# Altium schematic sheet Sheet1.SchDoc: Sheet 1
size A4; DrawnBy: Erhan YILMAZ; Engineer: Erhan YILMAZ; SheetNumber: 1; SheetTotal: 2; ProjectName: BMS
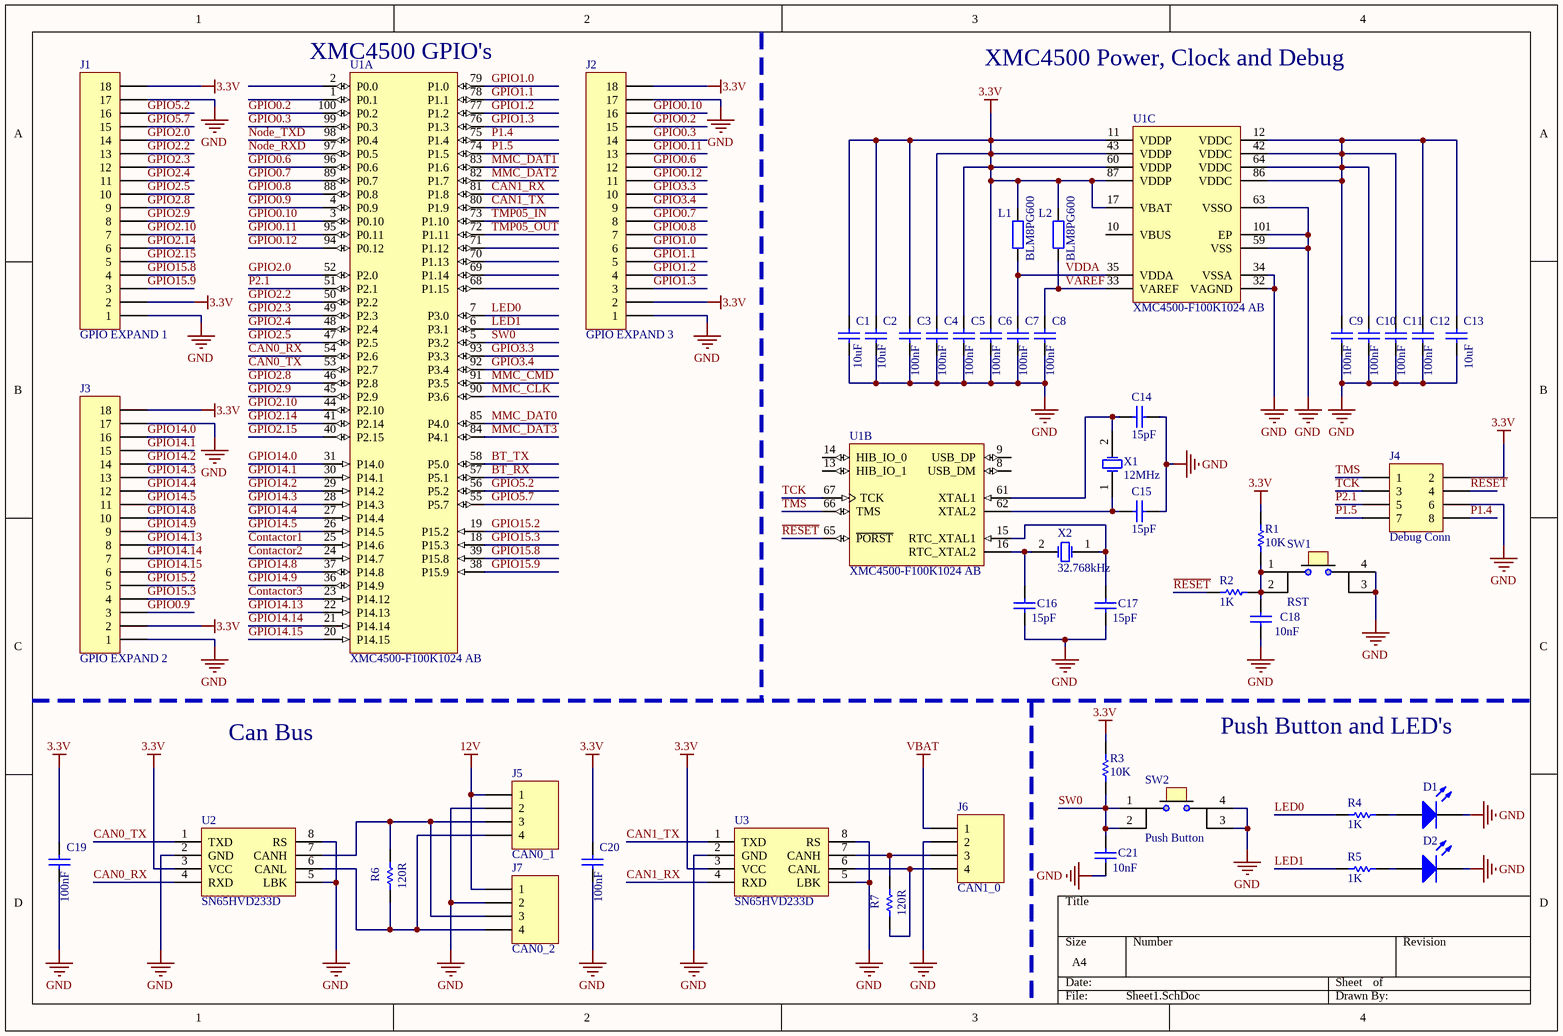
[diagram p0: Sheet1.SchDoc]

## Parts
C1  10uF  [C0805]
C2  10uF  [C0805]
C3  100nF  [1608[0603]]
C4  100nF  [1608[0603]]
C5  100nF  [1608[0603]]
C6  100nF  [1608[0603]]
C7  100nF  [1608[0603]]
C8  100nF  [1608[0603]]
C9  100nF  [1608[0603]]
C10  100nF  [1608[0603]]
C11  100nF  [1608[0603]]
C12  100nF  [1608[0603]]
C13  10uF  [C0805]
C14  15pF  [1608[0603]]
C15  15pF  [1608[0603]]
C16  15pF  [1608[0603]]
C17  15pF  [1608[0603]]
C18  10nF  [1608[0603]]
C19  100nF  [1608[0603]]
C20  100nF  [1608[0603]]
C21  10nF  [1608[0603]]
D1  SMD LED  [C0805]  (value not drawn)
D2  SMD LED  [C0805]  (value not drawn)
J1  GPIO EXPAND 1  [HDR1X18]
J2  GPIO EXPAND 3  [HDR1X18]
J3  GPIO EXPAND 2  [HDR1X18]
J4  Debug Conn  [HDR2X4]
J5  CAN0_1  [4 Pin header]
J6  CAN1_0  [4 Pin header]
J7  CAN0_2  [4 Pin header]
L1  BLM8PG600  [C0805]
L2  BLM8PG600  [C0805]
R1  10K  [1608[0603]]
R2  value 1K  [1608[0603]]  (hidden comment: 10K)
R3  10K  [1608[0603]]
R4  1K  [1608[0603]]
R5  1K  [1608[0603]]
R6  120R  [C0805]
R7  120R  [C0805]
SW1  RST  [Push Button SMD]
SW2  Push Button  [Push Button SMD]
U1  XMC4500-F100K1024 AB  [INF-PG-LQFP-100-11-7000X7000TP_N]  (parts A,B,C of 3)
U2  SN65HVD233D  [SOIC 8]
U3  SN65HVD233D  [SOIC 8]
X1  12MHz  [SMD Crystall 23.2x2.5mm]
X2  32.768kHz  [32kHz smd Crystal]

## Nets
3.3V: C1.2 C2.2 C3.2 C4.2 C5.2 C6.2 C19.2 C20.2 J1.2 J1.18 J2.2 J2.18 J3.2 J3.18 J4.2 L1.2 L2.2 R1.1 R3.1 U1.11(VDDP) U1.17(VBAT) U1.43(VDDP) U1.60(VDDP) U1.87(VDDP) U2.3(VCC) U3.3(VCC)
12V: J5.1 J7.1
GND: C1.1 C2.1 C3.1 C4.1 C5.1 C6.1 C7.1 C8.1 C9.1 C10.1 C11.1 C12.1 C13.1 C14.1 C15.1 C16.1 C17.1 C18.1 C19.1 C20.1 C21.1 D1.2(K) D2.2(K) J1.1 J1.17 J2.1 J2.17 J3.1 J3.17 J4.6 J5.2 J6.2 J7.2 SW1.3 SW1.4 SW2.3 SW2.4 U1.32(VAGND) U1.34(VSSA) U1.59(VSS) U1.63(VSSO) U1.101(EP) U2.2(GND) U2.5(LBK) U2.8(RS) U3.2(GND) U3.5(LBK) U3.8(RS)
VBAT: J6.1
BT_RX: U1.57(P5.1)
BT_TX: U1.58(P5.0)
CAN0_RX: U1.54(P2.6) U2.4(RXD)
CAN0_TX: U1.53(P2.7) U2.1(TXD)
CAN1_RX: U1.81(P1.8) U3.4(RXD)
CAN1_TX: U1.80(P1.9) U3.1(TXD)
Contactor1: U1.25(P14.6)
Contactor2: U1.24(P14.7)
Contactor3: U1.23(P14.12)
GPIO0.2: J2.15 U1.100(P0.2)
GPIO0.3: J2.14 U1.99(P0.3)
GPIO0.6: J2.12 U1.96(P0.6)
GPIO0.7: J2.8 U1.89(P0.7)
GPIO0.8: J2.7 U1.88(P0.8)
GPIO0.9: J3.3 U1.4(P0.9)
GPIO0.10: J2.16 U1.3(P0.10)
GPIO0.11: J2.13 U1.95(P0.11)
GPIO0.12: J2.11 U1.94(P0.12)
GPIO1.0: J2.6 U1.79(P1.0)
GPIO1.1: J2.5 U1.78(P1.1)
GPIO1.2: J2.4 U1.77(P1.2)
GPIO1.3: J2.3 U1.76(P1.3)
GPIO2.0: J1.14 U1.52(P2.0)
GPIO2.2: J1.13 U1.50(P2.2)
GPIO2.3: J1.12 U1.49(P2.3)
GPIO2.4: J1.11 U1.48(P2.4)
GPIO2.5: J1.10 U1.47(P2.5)
GPIO2.8: J1.9 U1.46(P2.8)
GPIO2.9: J1.8 U1.45(P2.9)
GPIO2.10: J1.7 U1.44(P2.10)
GPIO2.14: J1.6 U1.41(P2.14)
GPIO2.15: J1.5 U1.40(P2.15)
GPIO3.3: J2.10 U1.93(P3.3)
GPIO3.4: J2.9 U1.92(P3.4)
GPIO5.2: J1.16 U1.56(P5.2)
GPIO5.7: J1.15 U1.55(P5.7)
GPIO14.0: J3.16 U1.31(P14.0)
GPIO14.1: J3.15 U1.30(P14.1)
GPIO14.2: J3.14 U1.29(P14.2)
GPIO14.3: J3.13 U1.28(P14.3)
GPIO14.4: J3.12 U1.27(P14.4)
GPIO14.5: J3.11 U1.26(P14.5)
GPIO14.8: J3.10 U1.37(P14.8)
GPIO14.9: J3.9 U1.36(P14.9)
GPIO14.13: J3.8 U1.22(P14.13)
GPIO14.14: J3.7 U1.21(P14.14)
GPIO14.15: J3.6 U1.20(P14.15)
GPIO15.2: J3.5 U1.19(P15.2)
GPIO15.3: J3.4 U1.18(P15.3)
GPIO15.8: J1.4 U1.39(P15.8)
GPIO15.9: J1.3 U1.38(P15.9)
LED0: R4.2 U1.7(P3.0)
LED1: R5.2 U1.6(P3.1)
MMC_CLK: U1.90(P3.6)
MMC_CMD: U1.91(P3.5)
MMC_DAT0: U1.85(P4.0)
MMC_DAT1: U1.83(P1.6)
MMC_DAT2: U1.82(P1.7)
MMC_DAT3: U1.84(P4.1)
Node_RXD: U1.97(P0.5)
Node_TXD: U1.98(P0.4)
P1.4: J4.8 U1.75(P1.4)
P1.5: J4.7 U1.74(P1.5)
P2.1: J4.5 U1.51(P2.1)
~{RESET}: J4.4 R2.1 U1.65(~{PORST})
SW0: C21.2 R3.2 SW2.1 SW2.2 U1.5(P3.2)
TCK: J4.3 U1.67(TCK)
TMP05_IN: U1.73(P1.10)
TMP05_OUT: U1.72(P1.11)
TMS: J4.1 U1.66(TMS)
VAREF: C8.2 L2.1 U1.33(VAREF)
VDDA: C7.2 L1.1 U1.35(VDDA)
NetC9_2: C9.2 C10.2 C11.2 C12.2 C13.2 U1.12(VDDC) U1.42(VDDC) U1.64(VDDC) U1.86(VDDC)
NetC14_2: C14.2 U1.61(XTAL1) X1.2(OSC2)
NetC15_2: C15.2 U1.62(XTAL2) X1.1(OSC1)
NetC16_2: C16.2 U1.16(RTC_XTAL2) X2.2(OSC2)
NetC17_2: C17.2 U1.15(RTC_XTAL1) X2.1(OSC1)
NetC18_2: C18.2 R1.2 R2.2 SW1.1 SW1.2
NetD1_1: D1.1(A) R4.1
NetD2_1: D2.1(A) R5.1
NetJ5_3: J5.3 J7.3 R6.2 U2.7(CANH)
NetJ5_4: J5.4 J7.4 R6.1 U2.6(CANL)
NetJ6_3: J6.3 R7.2 U3.7(CANH)
NetJ6_4: J6.4 R7.1 U3.6(CANL)

Not connected (* = marked no-connect by the designer): U1 1(P0.1) 2(P0.0) 8(USB_DM) 9(USB_DP) 10(VBUS) 13(HIB_IO_1) 14(HIB_IO_0) 68(P1.15) 69(P1.14) 70(P1.13) 71(P1.12)

## Notes on the sheet
- (near U1) XMC4500 GPIO's
- XMC4500 Power, Clock and Debug
- Can Bus
- Push Button and LED's

## Library data of the parts
C1-C21 = Cap Semi: Published: 8-Jun-2000; LatestRevisionDate: 29-May-2009; LatestRevisionNote: IPC-7351 Footprint Added.; PackageReference: C1206; Publisher: Altium Limited; PackageDescription: Chip Capacitor
  C1 C2 C13: Value: 10uF
  C3-C12 C19 C20: Value: 100nF
  C14-C17: Value: 15pF
  C18 C21: Value: 10nF
D1 D2 = LED0: Published: 8-Jun-2000; LatestRevisionDate: 08-Jul-2005; LatestRevisionNote: Mech Layer 1 removed.; PackageReference: LED-0; Publisher: Altium Limited; PackageDescription: LED; 2 Leads; Value: SMD LED
J1-J3 = MHDR1X18: Header, 18-Pin; LatestRevisionDate: 17-Jul-2002; LatestRevisionNote: Re-released for DXP Platform.; Publisher: Altium Limited; Value: Header, 18-Pin
J4 = MHDR2X4: Header, 4-Pin, Dual row; LatestRevisionDate: 17-Jul-2002; LatestRevisionNote: Re-released for DXP Platform.; Publisher: Altium Limited; Value: Header, 4-Pin, Dual row
J5-J7 = 4 Pin Vertical Header: 4 pin header for CAN bus connectors
L1 L2 = Res2: Published: 8-Jun-2000; LatestRevisionDate: 17-Jul-2002; LatestRevisionNote: Re-released for DXP Platform.; PackageReference: AXIAL-0.4; Publisher: Altium Limited; PackageDescription: Axial Device, Thru-Hole; 2 Leads; 0.4 in Pin Spacing; Value: BLM8PG600
R1-R7 = Res1: Published: 8-Jun-2000; LatestRevisionDate: 17-Jul-2002; LatestRevisionNote: Re-released for DXP Platform.; PackageReference: AXIAL-0.3; Publisher: Altium Limited; PackageDescription: Axial Device, Thru-Hole; 2 Leads; 0.3 in Pin Spacing
  R1 R3: Value: 10K
  R4 R5: Value: 1K
  R6 R7: Value: 120R
SW1 SW2 = Push Button: General purposes push button; Value: Push Button
U1 = XMC4500-F100K1024 AB: 120 MHz XMC4500 MCU with 1,024 KByte Program Memory, 160 KByte SRAM, 3.3 V, -40 to 125 degC, PG-LQFP-100, Green; Manufacturer: Infineon; A / D input lines (incl. FADC): 18; Digital I/O Lines: 55; Program Memory: 1,024.0 KByte; SRAM (incl. Cache): 160.0 KByte; Type of Serial I/O Interfaces: 6xSPI, Dual SPI, Quad SPI, UART, LIN, IIC, IIS; DatasheetVersion: V1.0; PackageVersion: V11; PackageReference: PG-LQFP-100-11; PackageDescription: 100-Pin Plastic (Green) Low Profile Quad Flat Package, 14 x 14 mm Body, 0.5 mm Pitch; Halogen-free: TRUE; Mounting Technology: Surface Mount; PartNumber: XMC4500-F100K1024 AB; ComponentLink1Description: Manufacturer URL; ComponentLink1URL: http://www.infineon.com; ComponentLink2Description: Datasheet; ComponentLink2URL: http://www.infineon.com/dgdl/xmc4500_ds_v1+0_2013_01.pdf?folderId=db3a30433580b3710135a47f3eb76c98&fileId=db3a304335b504400135bdca7ed86742&location=en.Products.Microcontrollers.32-bit_Industrial_Microcontrollers_based_on_ARM__Cortex_-M.32-bit_XMC4000_Industrial_Microcontrollers_ARM__Cortex_-M4.DATASHEET.xmc4500_ds_v1 0_2013_01.pdf; ComponentLink3Description: Package Specification; ComponentLink3URL: http://www.infineon.com/dgdl/xmc4400_ds_v0.6_2012_11_.pdf?folderId=db3a30433580b3710135a47f3eb76c98&fileId=db3a30433afc7e3e013b3cfb455565a3&location=en.Products.Microcontrollers.32-bit_Industrial_Microcontrollers_based_on_ARM__Cortex_-M.32-bit_XMC4000_Industrial_Microcontrollers_ARM__Cortex_-M4.DATASHEET.xmc4400_ds_v0.6_2012_11_.pdf
U2 U3 = SN65HVD233D: SN65HVD233D 3.3V Can Tranceiver; Value: SN65HVD233D
X1 X2 = Crystall: General purposes crystall symbol